# EAGLE design Iridium_9603_Antenna (EAGLE 7.6.0)
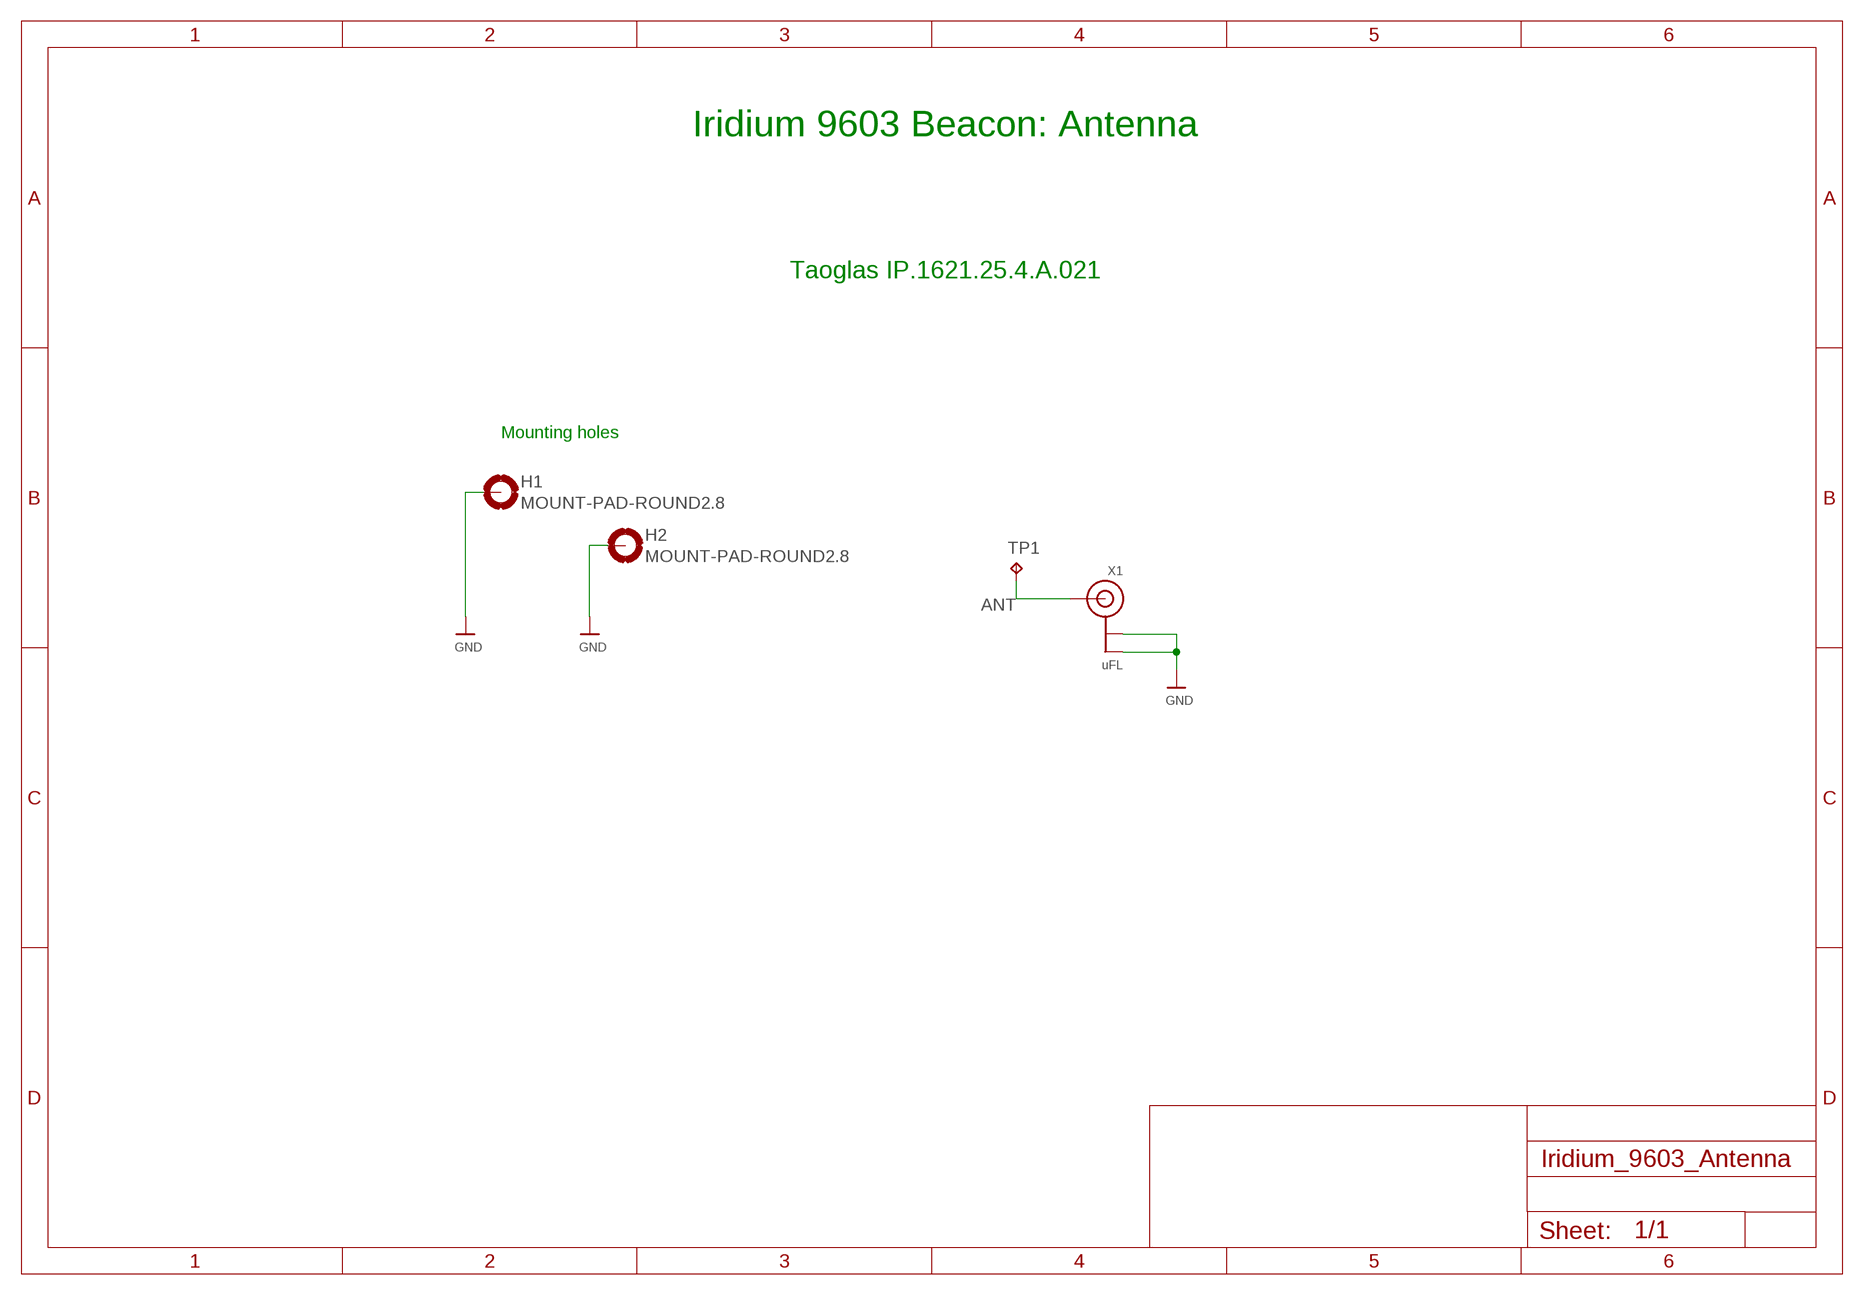
[diagram p0: schematic, sheet 1]

## Parts
H1  MOUNT-PAD-ROUND2.8  [2,8-PAD]
H2  MOUNT-PAD-ROUND2.8  [2,8-PAD]
TP1  TPB2,54  [B2,54]
X1  uFL  ANTENNA_U.FL  [U.FL]

## Nets
ANT: TP1.TP X1.3(SIGNAL)
GND: H1.B2,8(MOUNT) H2.B2,8(MOUNT) X1.1(GND) X1.2(GND)

## Notes on the sheet
- Iridium 9603 Beacon: Antenna
- Taoglas IP.1621.25.4.A.021
- Mounting holes

## Library data of the parts
H1 H2 = holes:MOUNT-PAD-ROUND: MOUNTING PAD, round
TP1 = testpad:TP: Test pad
X1 = microbuilder:ANTENNA_U.FL: U.FL Antenna Connector

## Board
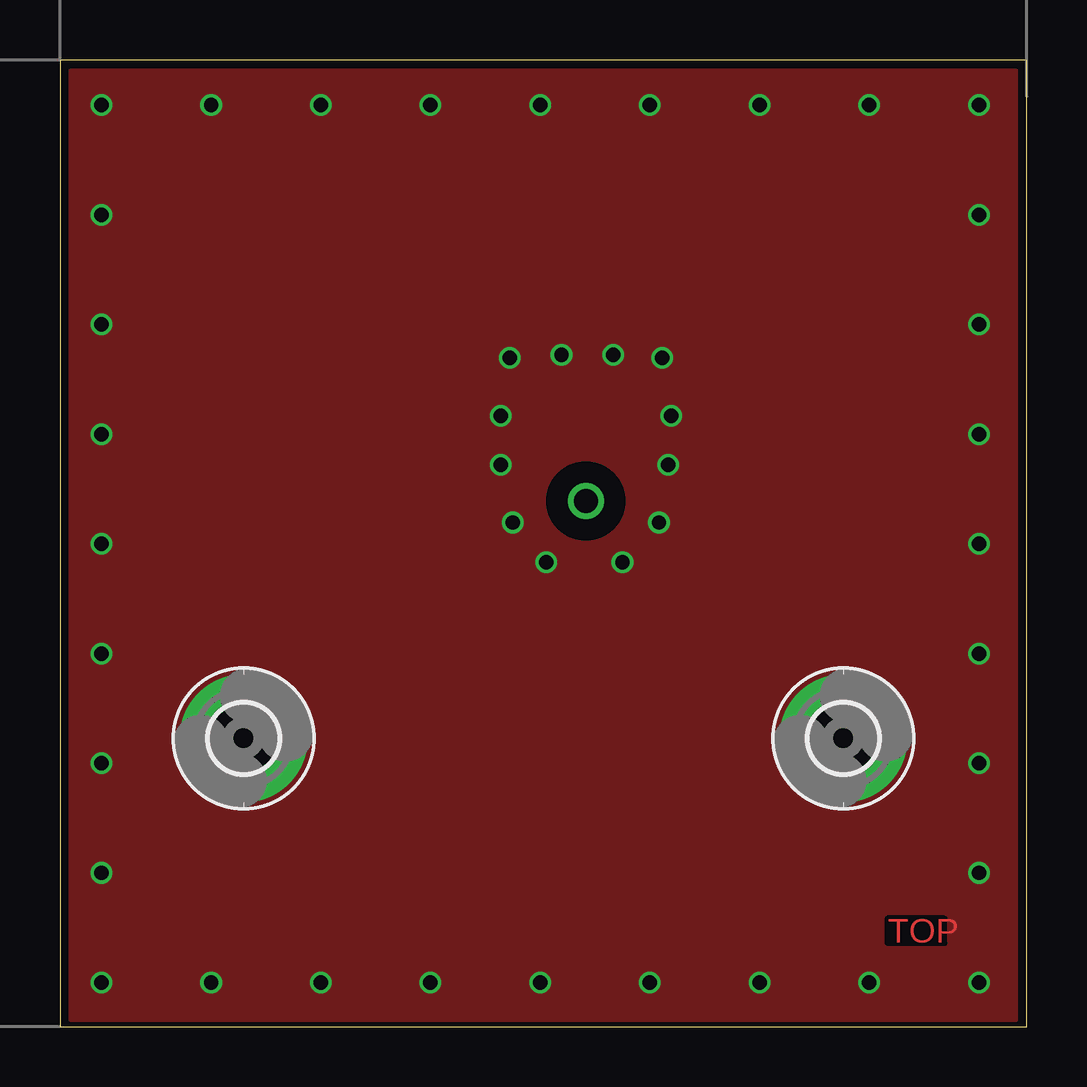
[diagram p1: board, top side]
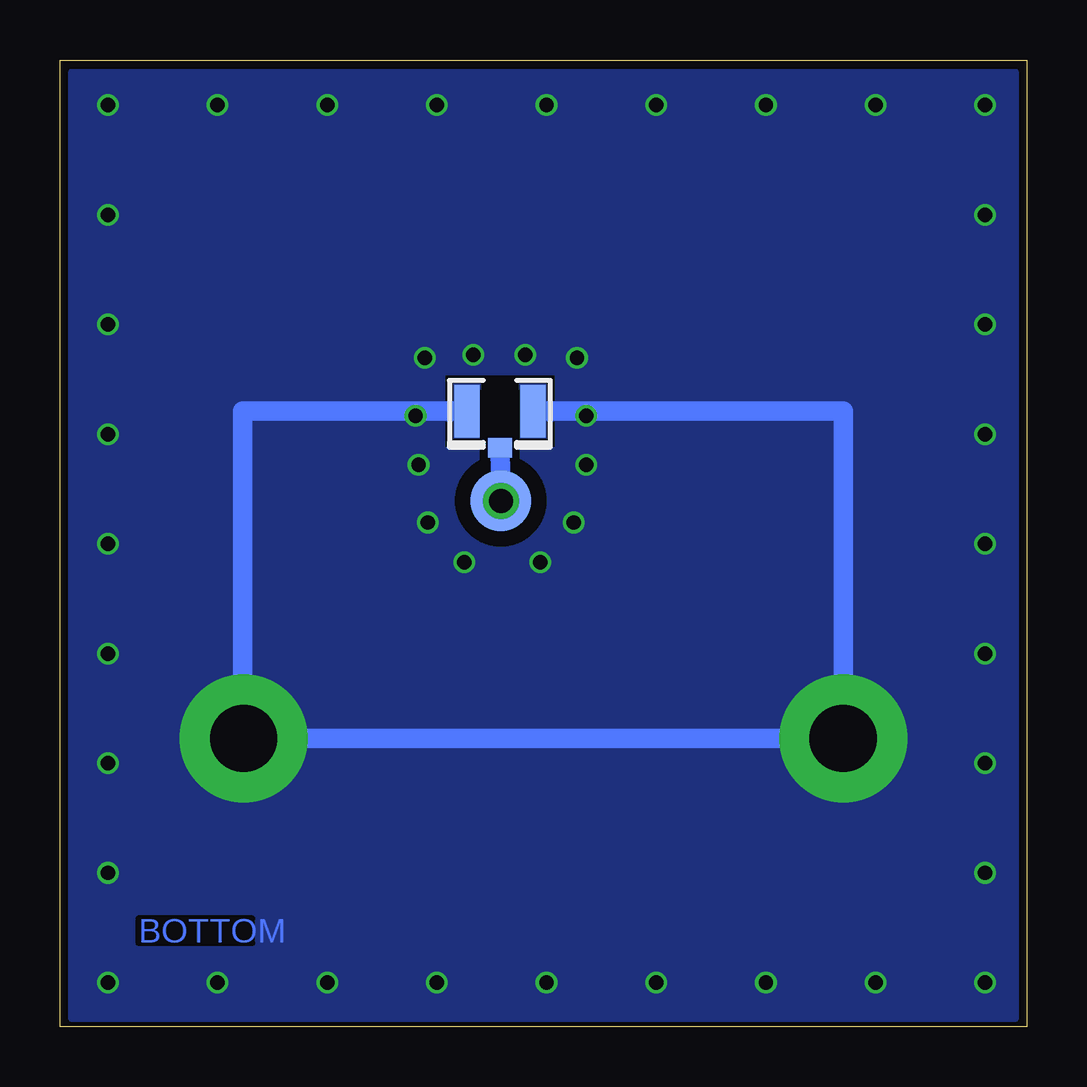
[diagram p2: board, bottom side, seen from below]

Size 40.3 x 40.3 mm. Coordinates in mm from the lower left corner, seen from the top.
Outline: 0,0 40.3,0 40.3,40.3 0,40.3 0,0
Copper layers (1*16): Top 0.018mm / dielectric 1.55mm / Bottom 0.018mm
Design rules "Multi-CB_2L_125um-Tracks_OL35um": minimum track width 0.125mm, minimum drill 0.2mm, track to track 0.125mm, track to pad 0.125mm, pad to pad 0.125mm, via to via 0.125mm, smd to smd 0mil, copper to edge 0.2mm, drill to drill 0.2mm, minimum pad ring 0.125mm, minimum via ring 0.125mm, stop-mask expansion 2mil, vias tented up to drill 0.45mm, thermal gap 0.2mm
tRestrict: area 20.4,20.4 to 23.4,23.4
bRestrict: area 20.1,20.1 to 23.7,23.7; area 22.5,23.5 to 22.8,24.7; area 21.1,23.5 to 21.4,24.7; area 19.9,24.2 to 21.2,24.5; area 22.7,24.2 to 24,24.5; area 19.7,24.2 to 20,25.2; area 23.9,24.2 to 24.2,25.2; area 19.7,26.1 to 20,27.1; area 23.9,26.1 to 24.2,27.1; area 19.7,26.8 to 24.2,27.1; area 21.2,26.5 to 22.7,26.8

### Footprints (pad centres in the part's own frame; a part is rotated, then mirrored left to right if it is on the bottom)
2,8-PAD = drill 2.8 pad 5.334: B2,8 0,0
B2,54 = smd 2.54 x 2.54: TP 0,0
U.FL = smd 2.2 x 1.05: 1 0,1.375; 2 0,-1.375 | smd 0.8 x 1: 3 1.525,0

### Placement (x,y rotation side)
H1  7.65,12.02 0 top
H2  32.65,12.02 0 top
TP1  21.92,21.92 0 bottom
X1  21.96,25.65 270 bottom

### Tracks (layer width: path | path; a pad name or v marks a point on that pad's centre or on a via)
ANT  (via drill 1 pad 1.27)
  Bottom 0.813: TP1.TP X1.3
  other vias: 21.92,21.92
GND  (via drill 0.6)
  Bottom 0.813: 32.69,12.02 H1.B2,8 7.65,25.65 X1.1 | 32.69,12.02 arc90 32.69,12.03 | 32.69,12.02 32.69,25.65 X1.2
  other vias: 25.48,25.46 18.37,25.46 18.37,23.43 25.35,23.43 24.97,21.02 23.45,19.37 20.27,19.37 18.87,21.02 18.75,27.88 25.1,27.88 23.07,28 20.91,28 1.73,38.42 38.31,38.42 38.31,1.84 1.73,1.84 1.73,20.13 1.73,29.27 1.73,33.85 1.73,24.7 1.73,10.99 1.73,15.56 1.73,6.41 20.02,1.84 10.87,1.84 6.3,1.84 15.45,1.84 29.16,1.84 24.59,1.84 33.73,1.84 38.31,20.13 38.31,29.27 38.31,33.85 38.31,24.7 38.31,10.99 38.31,15.56 38.31,6.41 20.02,38.42 10.87,38.42 6.3,38.42 15.45,38.42 29.16,38.42 24.59,38.42 33.73,38.42
  pour Top (no thermals): 0.46,0.32 39.83,0.32 39.83,39.81 0.46,39.81
  pour Bottom (no thermals): 0.46,0.32 39.83,0.32 39.83,39.81 0.46,39.81

### Text on the board
Top: TOP
Bottom: BOTTOM